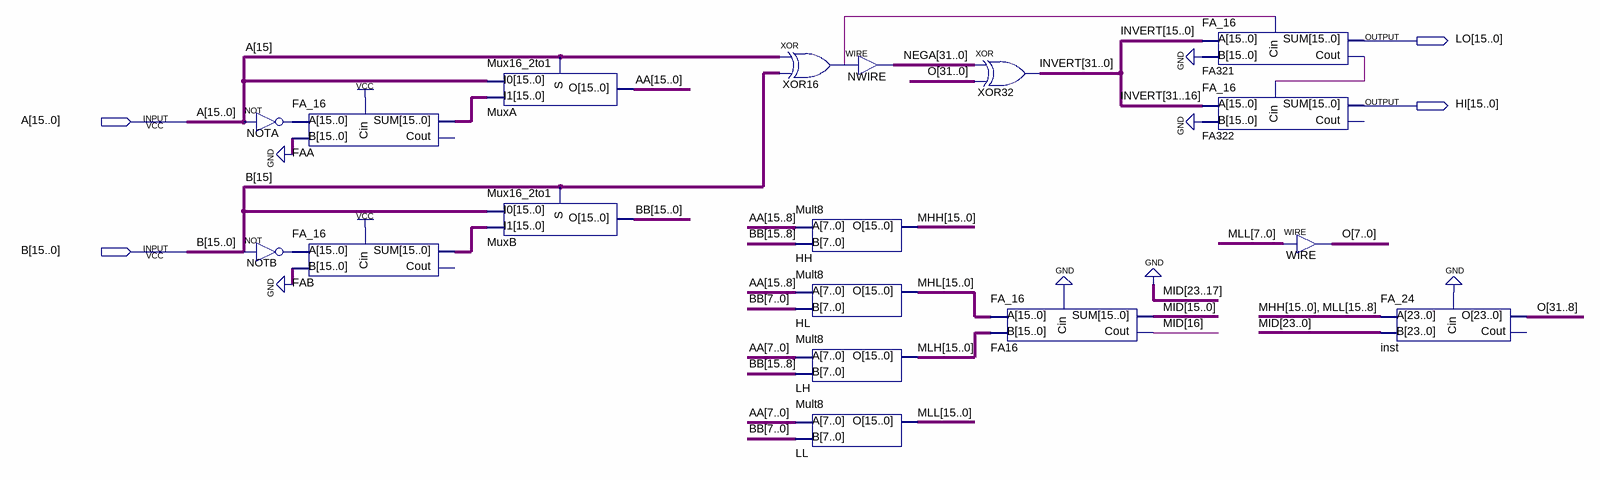
[diagram p0: schematic sheet]
// Quartus schematic Mult16bit.bdf as structural Verilog: 18 symbols, 4 pins
module Mult16bit (
  input  [15:0] A,
  input  [15:0] B,
  output [15:0] LO,
  output [15:0] HI
);

  wire FA321_cout, XOR16_out;
  wire [15:0] AA, BB, FAA_sum, FAB_sum, MHH, MHL, MLH, MLL, NOTA_out, NOTB_out;
  wire [16:0] MID;
  wire [31:0] INVERT, NEGA, O;

  assign NOTA_out = ~A;  // NOT NOTA, 16 bits wide
  assign NOTB_out = ~B;  // NOT NOTB, 16 bits wide
  FA_16 FAA (.Cin(1'b1), .A(NOTA_out), .B({16{1'b0}}), .SUM(FAA_sum));  // open: Cout
  FA_16 FAB (.Cin(1'b1), .A(NOTB_out), .B({16{1'b0}}), .SUM(FAB_sum));  // open: Cout
  Mux16_2to1 MuxA (.S(A[15]), .I0(A), .I1(FAA_sum), .O(AA));
  Mux16_2to1 MuxB (.S(B[15]), .I0(B), .I1(FAB_sum), .O(BB));
  xor XOR16 (XOR16_out, A[15], B[15]);
  assign NEGA = {32{XOR16_out}};  // WIRE NWIRE
  Mult8 HH (.A(AA[15:8]), .B(BB[15:8]), .O(MHH));
  Mult8 HL (.A(AA[15:8]), .B(BB[7:0]), .O(MHL));
  Mult8 LH (.A(AA[7:0]), .B(BB[15:8]), .O(MLH));
  Mult8 LL (.A(AA[7:0]), .B(BB[7:0]), .O(MLL));
  assign INVERT = NEGA ^ O;  // XOR XOR32, 32 bits wide
  FA_16 FA16 (.Cin(1'b0), .A(MHL), .B(MLH), .SUM(MID[15:0]), .Cout(MID[16]));
  FA_16 FA321 (.Cin(XOR16_out), .A(INVERT[15:0]), .B({16{1'b0}}), .SUM(LO), .Cout(FA321_cout));
  FA_16 FA322 (.Cin(FA321_cout), .A(INVERT[31:16]), .B({16{1'b0}}), .SUM(HI));  // open: Cout
  assign O[7:0] = MLL[7:0];  // WIRE WIRE
  FA_24 inst (.A({MHH, MLL[15:8]}), .B({{7{1'b0}}, MID}), .Cin(1'b0), .O(O[31:8]));  // open: Cout
endmodule
